# EAGLE design ESP-12_Adapter_v1.0 (EAGLE 7.2.0)
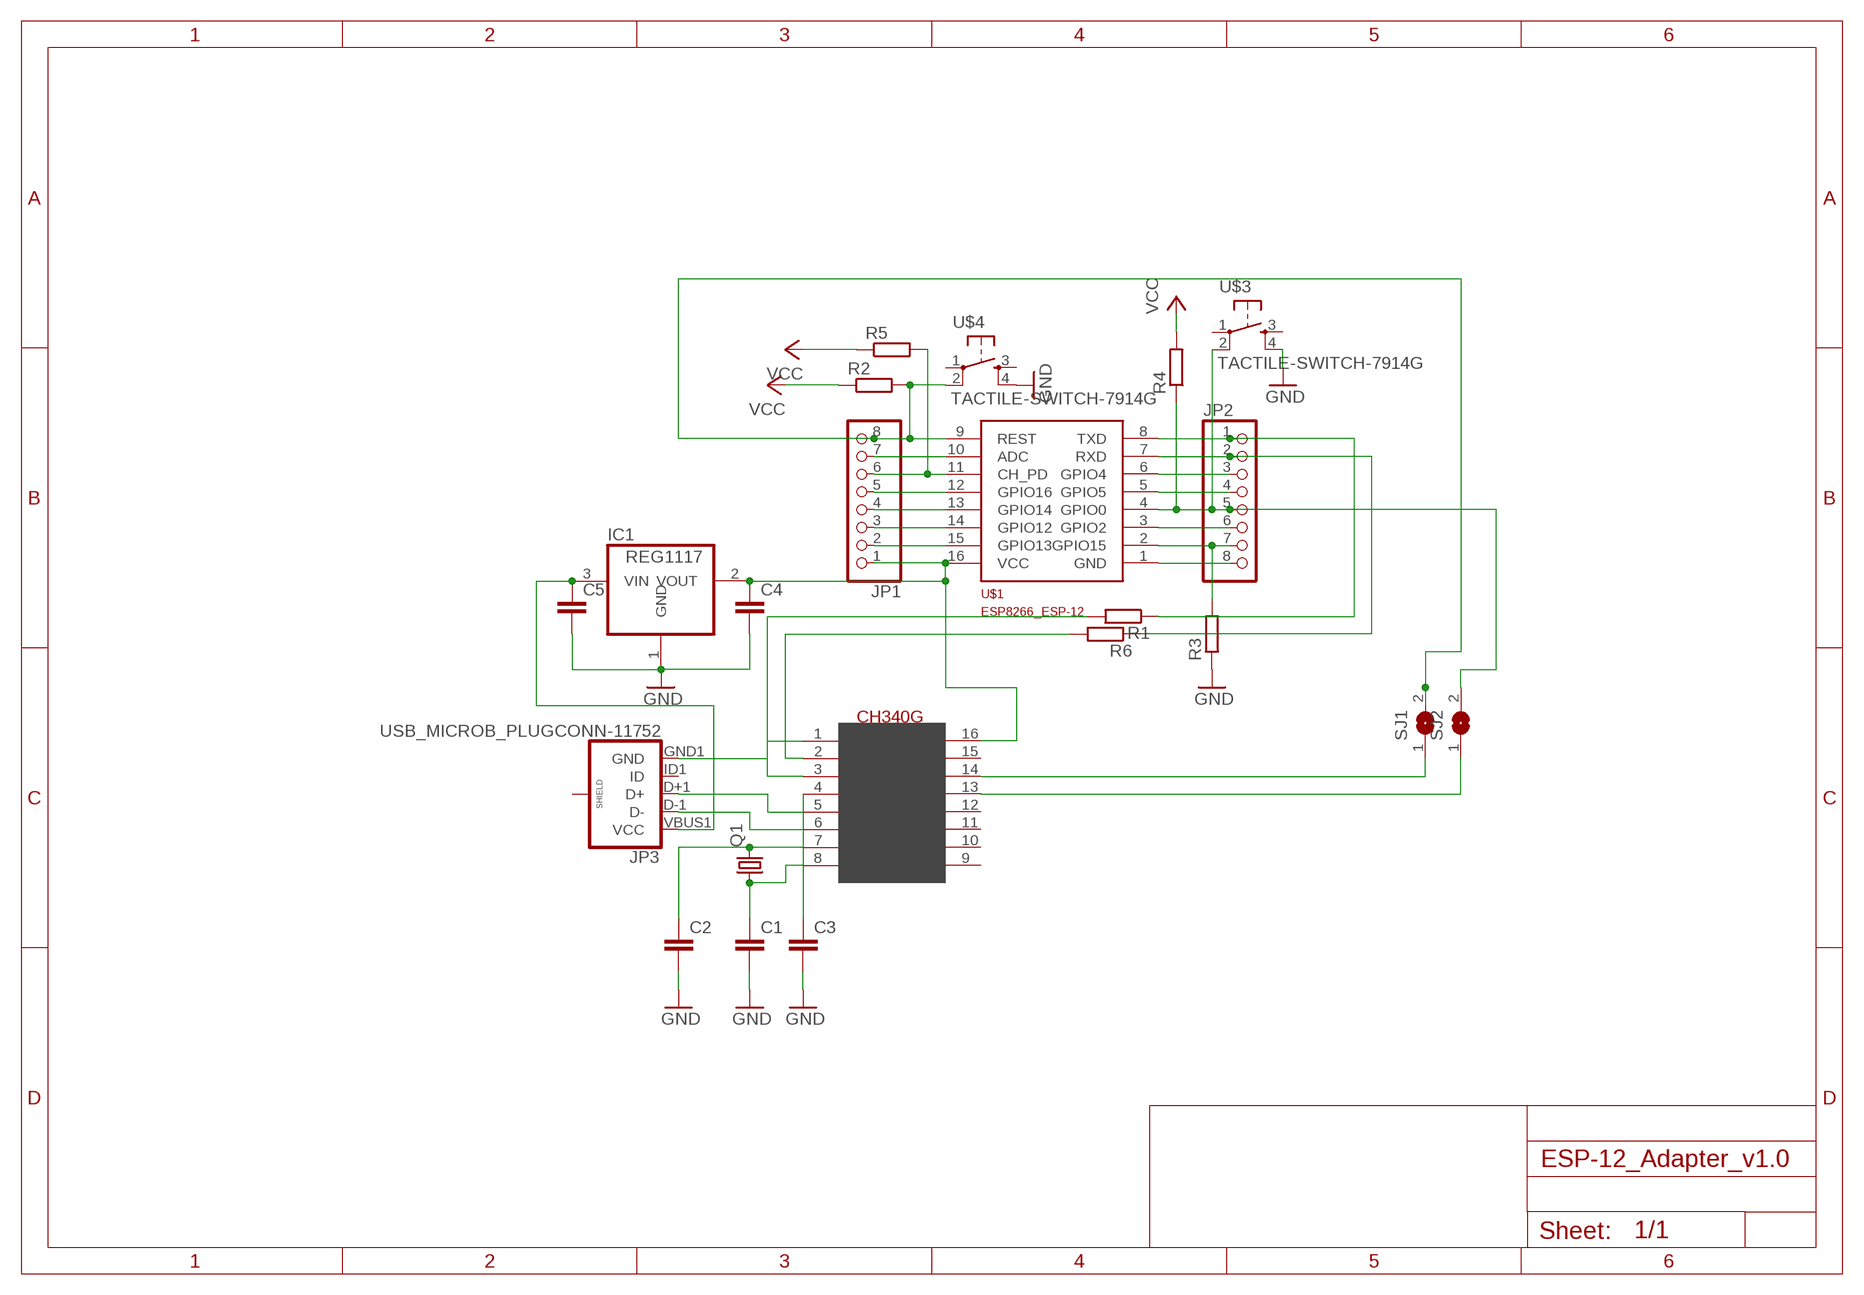
[diagram p0: schematic, sheet 1]

## Parts
C1  C-EUC0805  [C0805]
C2  C-EUC0805  [C0805]
C3  C-EUC0805  [C0805]
C4  C-EUC1206  [C1206]
C5  C-EUC1206  [C1206]
IC1  REG1117  [SOT223]
JP1  PINHD-1X8BIG  [1X08-BIG]
JP2  PINHD-1X8BIG  [1X08-BIG]
JP3  USB_MICROB_PLUGCONN-11752  [USB-B-MICRO-SMD_V03]
Q1  CRYSTALHC49UP  [HC49UP]
R1  R-EU_M0805  [M0805]
R2  R-EU_M0805  [M0805]
R3  R-EU_M0805  [M0805]
R4  R-EU_M0805  [M0805]
R5  R-EU_M0805  [M0805]
R6  R-EU_M0805  [M0805]
SJ1  SJ  [SJ]
SJ2  SJ  [SJ]
U$1  ESP8266_ESP-12  [ESP8266-ESP12]
U$2  CH340G  [SOIC16]
U$3  TACTILE-SWITCH-7914G  [7914G]
U$4  TACTILE-SWITCH-7914G  [7914G]

## Nets
GND: C1.2 C2.2 C3.2 C4.2 C5.2 IC1.1(GND) JP2.8 JP3.GND1(GND) R3.1 U$1.1(GND) U$2.1(GND) U$3.4 U$4.4
N$1: JP1.8 R2.2 SJ1.2 U$1.9(REST) U$4.2
N$2: JP1.7 U$1.10(ADC)
N$3: C5.1 IC1.3(VIN) JP3.VBUS1(VCC)
N$4: JP1.5 U$1.12(GPIO16)
N$5: JP1.4 U$1.13(GPIO14)
N$6: JP1.3 U$1.14(GPIO12)
N$7: JP1.2 U$1.15(GPIO13)
N$8: JP3.D+1(D+) U$2.5(D+)
N$9: JP3.D-1(D-) U$2.6(D-)
N$10: JP2.7 R3.2 U$1.2(GPIO15)
N$11: JP2.6 U$1.3(GPIO2)
N$13: JP2.4 U$1.5(GPIO5)
N$14: JP2.3 U$1.6(GPIO4)
N$15: JP2.1 R1.1 U$1.8(TXD)
N$16: R1.2 U$2.3(RX)
N$17: C3.1 U$2.4(V3)
N$18: JP1.6 R5.2 U$1.11(CH_PD)
N$19: C2.1 Q1.2 U$2.7(XI)
N$20: C1.1 Q1.1 U$2.8(XO)
N$21: JP2.2 R6.1 U$1.7(RXD)
N$22: R6.2 U$2.2(TX)
N$31: SJ1.1 U$2.14(RTS)
N$32: SJ2.1 U$2.13(DTR)
N$33: JP2.5 R4.1 SJ2.2 U$1.4(GPIO0) U$3.2
VCC: C4.1 IC1.2(VOUT) JP1.1 R2.1 R4.2 R5.1 U$1.16(VCC) U$2.16(VCC)
Unconnected: JP3.ID1(ID) JP3.SHIELD1(SHIELD) JP3.SHIELD2(SHIELD) JP3.SHIELD3(SHIELD) U$2.9(CTS) U$2.10(DSR) U$2.11(RI) U$2.12(DCD) U$2.15(RS232) U$3.1 U$3.3 U$4.1 U$4.3

## Library data of the parts
C1-C5 = rcl:C-EU: CAPACITOR, European symbol
IC1 = burr-brown:REG1117: 800mA and 1A Low Dropout (LDO) Positive Regulator 1.8V, 2.5V, 2.85V, 3.3V, 5V, and Adj; MPN: REG1117; OC_FARNELL: 1097566; OC_NEWARK: 14P6981
JP1 JP2 = adafruit:PINHD-1X8: PIN HEADER
JP3 = SparkFun-Connectors:USB_MICROB_PLUG: USB Micro-B connectors Some male, some female. Watch your step!
Q1 = crystal:CRYSTAL: CRYSTAL; OC_FARNELL: unknown; OC_NEWARK: unknown
R1-R6 = rcl:R-EU_: RESISTOR, European symbol
SJ1 SJ2 = jumper:SJ: SMD solder JUMPER
U$1 = ESP8266-ESP12:ESP8266_ESP-12
U$2 = usb-serial:CH340G
U$3 U$4 = GeekAmmo:TACTILE-SWITCH: Tactile Switch 4 Pins, SPST NO

## Net classes
0 GND: width 0.254 mm

## Board
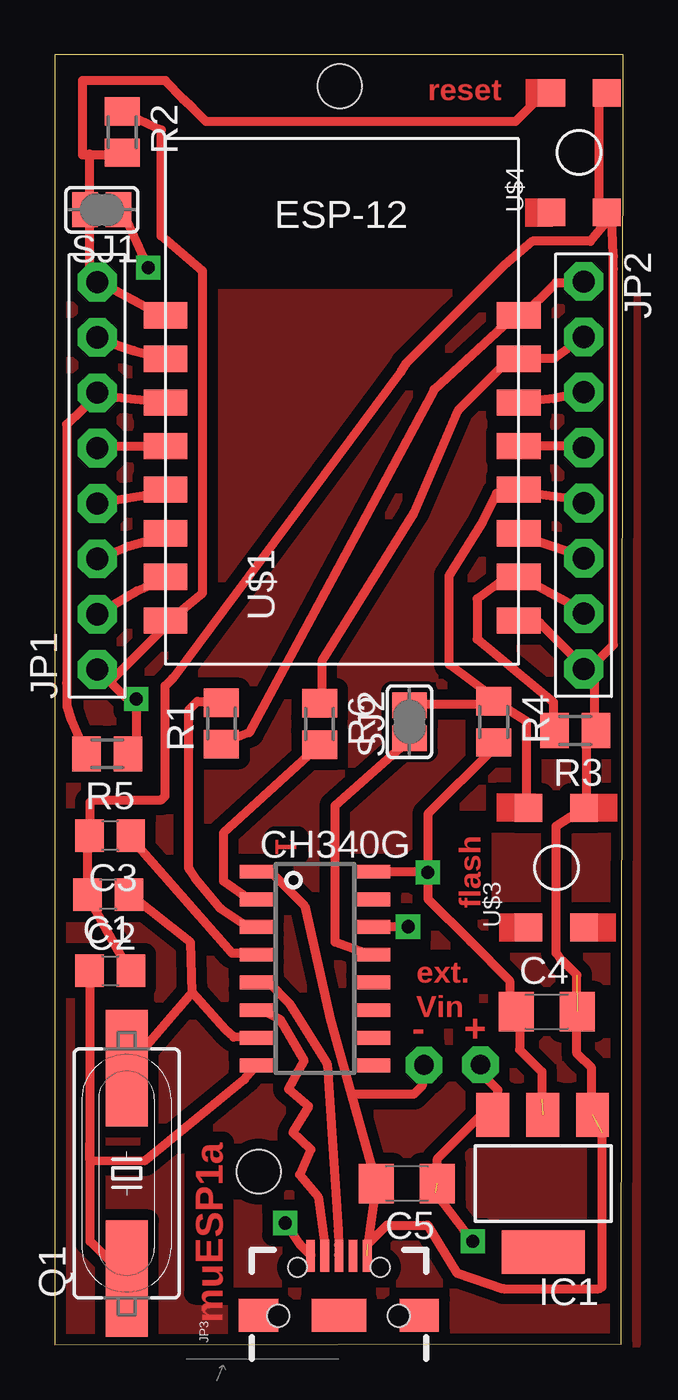
[diagram p1: board, top side]
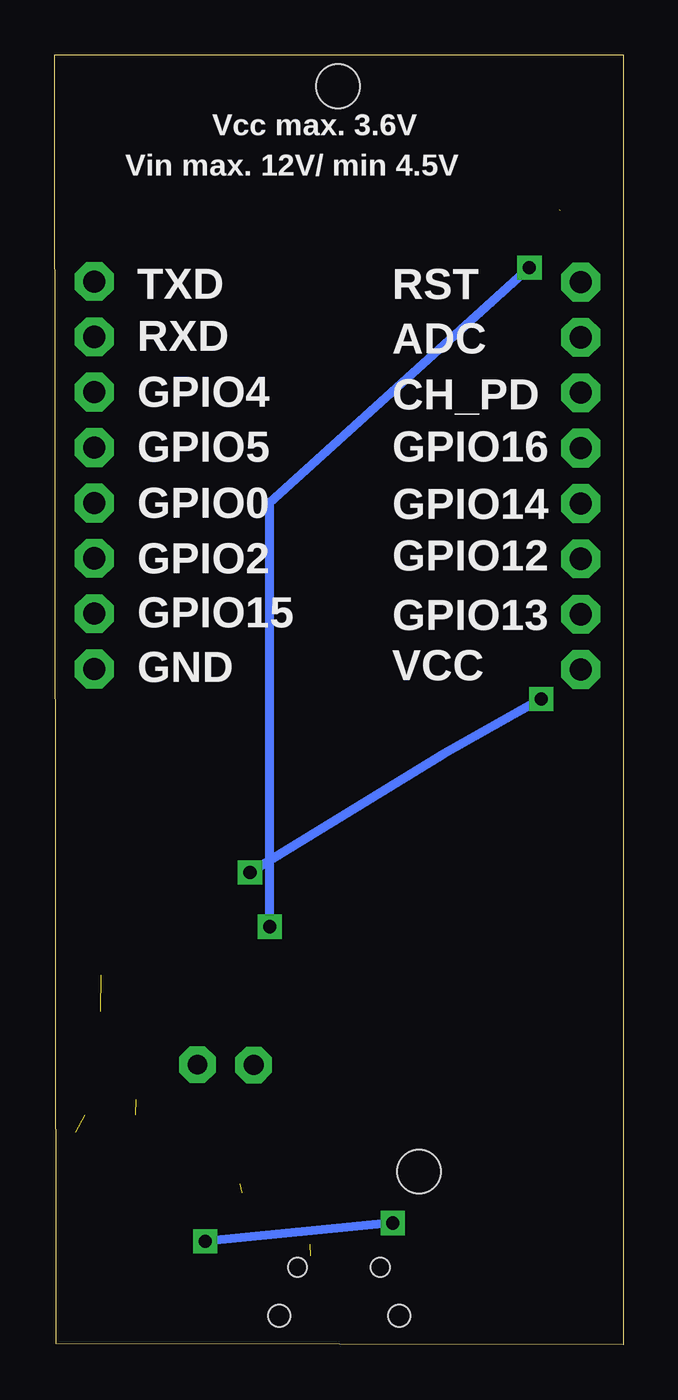
[diagram p2: board, bottom side, seen from below]

Size 26.09 x 59.21 mm. Coordinates in mm from the lower left corner, seen from the top.
Outline: 0.01,0 26,0.05 26.09,59.21 0,59.21 0.01,0
Copper layers (1*16): Top 0.035mm / dielectric 1.5mm / Bottom 0.035mm
Design rules "Markus *": minimum track width 8mil, minimum drill 20mil, track to track 8mil, track to pad 8mil, pad to pad 8mil, via to via 8mil, smd to smd 8mil, copper to edge 8mil, drill to drill 8mil, minimum pad ring 12mil, minimum via ring 10mil, stop-mask expansion 4mil, vias tented up to drill 25mil, thermal gap 10mil
Holes 2 mm at 13.08,57.75 9.37,7.96
Holes 1 mm at 10.27,1.35 15.79,1.35

### Footprints (pad centres in the part's own frame; a part is rotated, then mirrored left to right if it is on the bottom)
C0805 = smd 1.3 x 1.5: 1 -0.95,0; 2 0.95,0
C1206 = smd 1.6 x 1.8: 1 -1.4,0; 2 1.4,0
SOT223 = smd 1.499 x 2.007: 1 -2.261,-3.15; 2 0.025,-3.15; 3 2.311,-3.15 | smd 3.81 x 2.007: 4 0,3.15
1X08-BIG = drill 1.016 pad 1.778 octagon: 1 -8.89,0; 2 -6.35,0; 3 -3.81,0; 4 -1.27,0; 5 1.27,0; 6 3.81,0; 7 6.35,0; 8 8.89,0
USB-B-MICRO-SMD_V03 = smd 1.45 x 0.4: D+1 2.725,0; D-1 2.725,0.65; GND1 2.725,-1.3; ID1 2.725,-0.65; VBUS1 2.725,1.3 | smd 1.5 x 1.8: SHIELD1 0,3.685; SHIELD2 0,-3.685 | smd 1.5 x 2.5: SHIELD3 0,0 | hole 0.85: 2.2,1.9; 2.2,-1.9
HC49UP = smd 5.334 x 1.93: 1 -4.826,0; 2 4.826,0
M0805 = smd 1.3 x 1.6: 1 -0.95,0; 2 0.95,0
SJ = smd 1.168 x 1.6: 1 -0.762,0; 2 0.762,0
ESP8266-ESP12 = smd 2 x 1.2: 1 16.2,2; 2 16.2,4; 3 16.2,6; 4 16.2,8; 5 16.2,10; 6 16.2,12; 7 16.2,14; 8 16.2,16; 9 0,16; 10 0,14; 11 0,12; 12 0,10; 13 0,8; 14 0,6; 15 0,4; 16 0,2
SOIC16 = smd 0.635 x 1.524: 1 -4.445,-2.695; 2 -3.175,-2.695; 3 -1.905,-2.695; 4 -0.635,-2.695; 5 0.635,-2.695; 6 1.905,-2.695; 7 3.175,-2.695; 8 4.445,-2.695; 9 4.445,2.695; 10 3.175,2.695; 11 1.905,2.695; 12 0.635,2.695; 13 -0.635,2.695; 14 -1.905,2.695; 15 -3.175,2.695; 16 -4.445,2.695
7914G = smd 1.27 x 1.27: 1 0,0; 2 0,5.486; 3 2.54,0; 4 2.54,5.486

### Placement (x,y rotation side)
C1  2.55,17.18 0 top
C2  2.47,20.67 180 top
C3  2.55,23.37 180 top
C4  22.58,15.3 0 top
C5  16.16,7.4 180 top
IC1  22.41,7.41 180 top
JP1  1.96,39.88 90 top
JP2  24.27,39.9 270 top
JP3  13.04,1.37 90 top
Q1  3.31,7.87 90 top
R1  7.65,28.52 90 top
R2  3.11,55.65 270 top
R3  23.89,28.19 180 top
R4  20.14,28.59 270 top
R5  2.41,27.12 180 top
R6  12.16,28.49 270 top
SJ1  2.17,52.08 180 top
SJ2  16.28,28.59 90 top
U$1  5.09,31.24 0 top
U$2  11.95,17.27 270 top
U$3  21.75,19.16 0 top
U$4  22.79,51.96 0 top

### Tracks (layer width: path | path; a pad name or v marks a point on that pad's centre or on a via)
GND  (3 unrouted)
  Top 0.406: IC1.1 24.63,11.24 24.63,12.71 23.96,13.38 23.96,16.97 23.28,17.64 23.24,17.64 23.01,17.98 23.01,23.81 U$3.4 24.39,24.75 24.39,27.75 24.76,28.12 R3.1 24.76,28.25 24.76,30.62 24.51,30.88 JP2.8 | C1.2 3.38,17.25 2.54,18.75 1.51,20.62 C2.2 1.51,20.75 1.51,23.25 C3.2 1.49,23.29 1.63,23.43 1.63,24.91 1.74,25.01 4.9,25.01 5.08,25.18 5.08,30.23 5.42,30.58 15.89,44.65 16.11,45.02 20.61,49.52 21.92,50.63 24.58,50.63 25.46,51.71 25.53,51.71 | JP2.8 24.51,31 25.64,32.12 25.64,49.38 25.64,49.94 25.62,50.01 25.57,51.67 25.53,51.71 | U$1.1 21.39,33.12 22.26,33.12 24.39,31 JP2.8 | 9.63,21.75 U$2.1 9.9,21.72 11.47,20.14 12.65,14.95 C5.2 14.37,4.62 15.24,5.5 17.12,5.5 18.45,3.31 20.59,2.58 24.97,2.58 25.11,2.67 25.12,9.76 | 25.53,51.71 25.53,51.97 24.99,52.5 24.99,57.11 U$4.4
N$1
  Top 0.406: 3.01,54.62 R2.2 2.98,54.63 2.52,54.63 2.52,54.61 | U$1.9 5.01,47.25 4.78,47.31 2.13,48.75 JP1.8 | 2.38,48.62 JP1.8 | 1.61,54.61 1.28,54.61 1.28,58.01 5.09,58.01 5.9,57.15 6.36,56.73 6.94,56.15 21.15,56.15 22.45,57.45 U$4.2 | 1.61,54.61 2.52,54.61 | 2.52,54.61 2.55,54.61 | 1.61,54.61 1.61,52.12 SJ1.2 1.61,51.89 1.61,49.15 1.84,48.92 JP1.8 | 1.61,54.63 1.61,54.61
N$2
  Top 0.406: U$1.10 5.01,45.25 3.62,45.63 2.13,46.12 JP1.7
N$3  (via drill 0.6)  (1 unrouted)
  Top 0.406: JP3.VBUS1 11.76,4.12 11.23,4.65 v10.57,5.59 | IC1.3 19.51,10.5 17.56,8.55 C5.1 | v19.18,4.75 17.49,6.98
  Bottom 0.406: v10.57,5.59 v19.18,4.75
N$4
  Top 0.406: U$1.12 5.01,41.25 2.13,41.25 JP1.5
N$5
  Top 0.406: U$1.13 5.01,39.12 2.78,38.77 2.13,38.62 JP1.4
N$6
  Top 0.406: U$1.14 5.01,37.12 3.39,36.66 2.13,36.12 JP1.3
N$7
  Top 0.406: U$1.15 5.01,35.12 3.78,34.59 2.13,33.62 JP1.2
N$8
  Top 0.406: JP3.D+1 13.04,4.13 13.04,4.58 13,5.23 12.5,12.89 11.02,15.28 10.78,15.66 9.81,16.62 9.26,16.62 U$2.5
N$9
  Top 0.406: JP3.D-1 12.4,4.61 12.1,6.79 11.24,7.81 11.76,8.97 10.93,9.75 11.65,10.95 10.72,11.74 11.44,13.03 11.45,13.03 10.32,14.96 9.79,15.24 9.26,15.25 U$2.6
N$10
  Top 0.406: R3.2 22.89,28.25 22.89,29.5 19.39,32.38 19.39,34.23 21.14,35.52 21.68,35.12 U$1.2 21.39,35.25 23.27,34.22 24.39,33.62 JP2.7
N$11
  Top 0.406: U$1.3 21.39,37.12 23.07,36.57 24.39,36.12 JP2.6
N$12
  pour Top (isolate 0.5): 25.41,0 0.01,0 0.01,48.26 26.68,48.26 26.68,0
N$13
  Top 0.406: U$1.5 21.39,41.25 24.39,41.25 JP2.4
N$14
  Top 0.406: U$1.6 21.39,43.25 22.9,43.42 24.39,43.75 JP2.3
N$15
  Top 0.406: R1.1 7.76,27.62 8.93,28.09 17.41,43.84 21.14,47.25 21.26,47.12 U$1.8 21.39,47.12 23.01,48.75 24.39,48.75 JP2.1
N$16
  Top 0.406: 8.88,19.25 9.13,19.25 U$2.3 8.75,19.24 7.63,20.02 7.6,20.04 6.46,21.39 6.18,21.83 6.17,21.85 6.17,29.14 6.55,29.53 7.59,29.53 R1.2
N$17
  Top 0.406: C3.1 3.51,23.25 8.14,17.98 8.52,17.98 9.13,18 U$2.4
N$18
  Top 0.406: 1.76,27.62 R5.2 0.78,28.67 0.57,29.32 0.55,30.36 0.55,42.23 2.01,43.62 JP1.6 2.13,43.62 2.62,43.51 5.01,43.25 U$1.11
N$19
  Top 0.406: 6.33,16.19 7.85,14.45 8.21,14.13 9.13,14.12 U$2.7 | 6.33,16.19 6.24,18.47 3.51,20.62 C2.1 | 6.33,16.19 3.38,12.75 Q1.2
N$20
  Top 0.406: 1.64,10.12 1.64,4.75 3.26,3.12 Q1.1 | 1.64,10.12 1.64,17.12 C1.1 | U$2.8 8.71,12.19 4.13,8.46 1.62,8.47 1.64,10.12
N$21
  Top 0.406: R6.1 12.26,29.5 12.26,31.38 16.46,38.16 18.5,42.86 21,45.36 21.26,45.12 U$1.7 21.39,45.25 20.8,45.27 22.92,45.27 JP2.2
N$22
  Top 0.406: U$2.2 9.13,20.5 8.88,20.5 7.75,21.29 7.75,23.48 12.13,27.5 R6.2
N$24
  Top 0.406: 16.86,12.22 16.86,11.9 16.46,11.51 13.67,11.51 13.62,11.55
N$25
  Top 0.406: 20.33,11.43 20.33,11.71 19.81,12.23
N$27  (via drill 0.9 pad 1.68)
  other vias: 19.54,12.87
N$28  (via drill 0.9 pad 1.68)
  other vias: 16.95,12.85
N$31  (via drill 0.6)  (1 unrouted)
  Top 0.406: 2.82,51.97 SJ1.1 3.25,51.76 v4.3,49.42 | 2.82,52.14 2.89,52.07 | 14.66,19.16 U$2.14 14.66,19.2 v16.21,19.2
  Bottom 0.406: v16.21,19.2 16.21,38.65 v4.3,49.42
N$32
  Top 0.406: U$2.13 14.63,18 14.26,18 12.86,18.48 12.86,24.73 16.26,27.75 SJ2.1
N$33
  Top 0.406: JP2.5 24.39,38.62 23.56,38.83 21.39,39.12 U$1.4 21.26,39.12 20.53,39.07 20.28,39.07 19.64,37.75 18.1,35.3 18.11,31.22 20.26,29.62 R4.1 | U$3.2 21.64,24.75 21.64,28.63 20.26,29.5 R4.1 | SJ2.2 16.39,29.38 20.26,29.38 R4.1
VCC  (via drill 0.6)  (1 unrouted)
  Top 0.406: 21.89,10.5 IC1.2 | R5.1 3.63,27.62 3.75,27.75 v3.75,29.64 | R2.1 3.13,56.5 3.26,56.5 4.9,55.73 4.9,52.67 4.88,53.12 4.88,50.9 6.79,49.27 6.79,34.5 5.13,33.12 U$1.16 5.13,33 2.63,30.5 JP1.1 2.13,30.88 2.13,30.84 3.24,29.73 3.67,29.73 v3.75,29.64 | v3.75,29.64 3.63,29.52 | C4.1 21.08,15.39 | C4.1 21.34,15.14 21.34,13.55 22.35,12.54 22.35,11.27 | U$2.16 17.09,21.72 v17.12,21.68 | v17.12,21.68 17.12,20.48 19.08,18.52 19.08,18.51 20.88,16.71 20.88,15.6 C4.1 | R4.2 20.14,27.38 17.12,24.36 v17.12,21.69 v17.12,21.68
  Bottom 0.406: v3.75,29.64 8.22,27.12 v17.12,21.68
(copper drawn outside any net)
  shapes: Top area x7

### Text on the board
Top: reset | 1 | flash | ext. | Vin | - | + | muESP1a
_bsilk: Vcc max. 3.6V | Vin max. 12V/ min 4.5V | RST | TXD | RXD | ADC | CH_PD | GPIO4 | GPIO16 | GPIO5 | GPIO14 | GPIO0 | GPIO12 | GPIO2 | GPIO13 | GPIO15 | VCC | GND